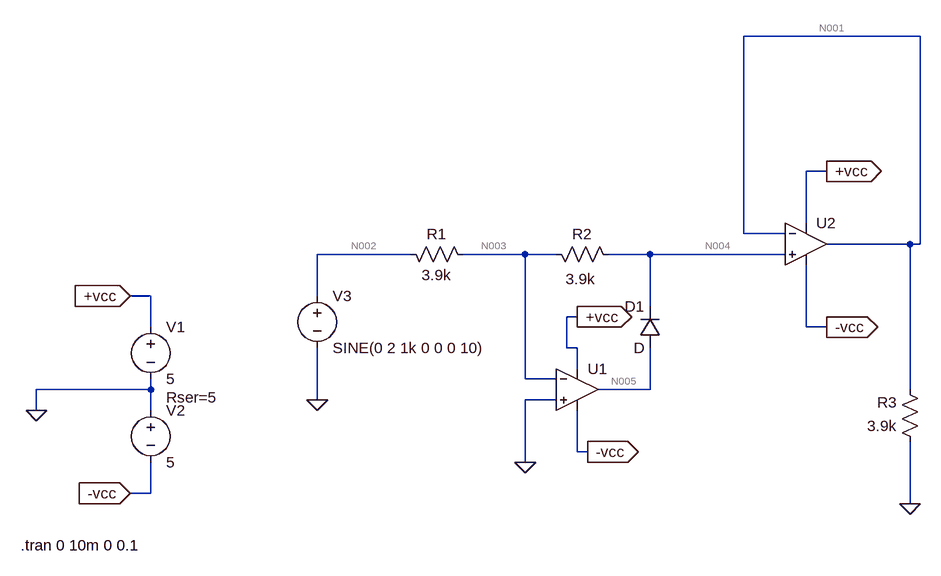
[diagram p0: schematic rectificador.asc]
rectificador.asc, the LTspice schematic file:
Version 4
SHEET 1 1236 680
WIRE 1184 -368 912 -368
WIRE 1040 -160 1008 -160
WIRE 1008 -80 1008 -160
WIRE 912 -64 912 -368
WIRE 976 -64 912 -64
WIRE 1168 -48 1040 -48
WIRE 1184 -48 1184 -368
WIRE 1184 -48 1168 -48
WIRE 400 -32 256 -32
WIRE 576 -32 480 -32
WIRE 624 -32 576 -32
WIRE 768 -32 704 -32
WIRE 976 -32 768 -32
WIRE 0 32 -32 32
WIRE 256 32 256 -32
WIRE 768 48 768 -32
WIRE 656 64 640 64
WIRE 0 80 0 32
WIRE 1008 80 1008 -16
WIRE 1040 80 1008 80
WIRE 640 112 640 64
WIRE 656 112 640 112
WIRE 656 144 656 112
WIRE 576 160 576 -32
WIRE 624 160 576 160
WIRE 0 176 0 160
WIRE 0 176 -176 176
WIRE 768 176 768 112
WIRE 768 176 688 176
WIRE 1168 176 1168 -48
WIRE 256 192 256 112
WIRE 624 192 576 192
WIRE -176 208 -176 176
WIRE 0 208 0 176
WIRE 656 272 656 208
WIRE 672 272 656 272
WIRE 576 288 576 192
WIRE 0 336 0 288
WIRE 0 336 -32 336
WIRE 1168 352 1168 256
FLAG -176 208 0
FLAG 256 192 0
FLAG 1168 352 0
FLAG 576 288 0
FLAG -32 32 +vcc
IOPIN -32 32 In
FLAG -32 336 -vcc
IOPIN -32 336 In
FLAG 656 64 +vcc
IOPIN 656 64 Out
FLAG 1040 -160 +vcc
IOPIN 1040 -160 Out
FLAG 1040 80 -vcc
IOPIN 1040 80 Out
FLAG 672 272 -vcc
IOPIN 672 272 Out
SYMBOL voltage 0 64 R0
WINDOW 123 0 0 Left 2
WINDOW 39 24 124 Left 2
SYMATTR SpiceLine Rser=5
SYMATTR InstName V1
SYMATTR Value 5
SYMBOL voltage 0 192 R0
WINDOW 123 0 0 Left 2
WINDOW 39 0 0 Left 2
SYMATTR InstName V2
SYMATTR Value 5
SYMBOL res 384 -48 M90
WINDOW 0 0 56 VBottom 2
WINDOW 3 32 56 VTop 2
SYMATTR InstName R1
SYMATTR Value 3.9k
SYMBOL res 608 -48 M90
WINDOW 0 0 56 VBottom 2
WINDOW 3 38 53 VTop 2
SYMATTR InstName R2
SYMATTR Value 3.9k
SYMBOL res 1184 272 R180
WINDOW 0 36 76 Left 2
WINDOW 3 36 40 Left 2
SYMATTR InstName R3
SYMATTR Value 3.9k
SYMBOL diode 784 112 R180
WINDOW 0 24 64 Left 2
WINDOW 3 24 0 Left 2
SYMATTR InstName D1
SYMBOL voltage 256 16 R0
WINDOW 123 0 0 Left 2
WINDOW 39 0 0 Left 2
SYMATTR InstName V3
SYMATTR Value SINE(0 2 1k 0 0 0 10)
SYMBOL Opamps\\UniversalOpamp2 656 176 R0
SYMATTR InstName U1
SYMBOL Opamps\\UniversalOpamp2 1008 -48 R0
SYMATTR InstName U2
TEXT -200 416 Left 2 !.tran 0 10m 0 0.1

The netlist it stands for:
* rectificador.asc
V1 +vcc 0 5 Rser=5
V2 0 -vcc 5
R1 N002 N003 3.9k
R2 N003 N004 3.9k
R3 0 N001 3.9k
D1 N005 N004 D
V3 N002 0 SINE(0 2 1k 0 0 0 10)
XU1 0 N003 +vcc -vcc N005 level.2 Avol=1Meg GBW=10Meg Slew=10Meg ilimit=25m rail=0 Vos=0 phimargin=45 en=0 enk=0 in=0 ink=0 Rin=500Meg  ; pins IN+ IN- V+ V- OUT
XU2 N004 N001 +vcc -vcc N001 level.2 Avol=1Meg GBW=10Meg Slew=10Meg ilimit=25m rail=0 Vos=0 phimargin=45 en=0 enk=0 in=0 ink=0 Rin=500Meg  ; pins IN+ IN- V+ V- OUT
.model D D
.lib standard.dio
.tran 0 10m 0 0.1
.lib UniversalOpamps2.sub
.backanno
.end

* Results of the author's LTspice run, read from the files saved beside the schematic
* Operating Point, zero values left out:
*   V(+vcc) = 4.995 V
*   V(-vcc) = -5 V
*   V(n003) = -38.72 nV
*   V(n004) = -57.95 nV
*   V(n001) = -60.46 nV
*   V(n005) = 36.04 mV
*   I(R3) = 15.5 pA
*   I(R2) = 4.931 pA
*   I(R1) = 9.928 pA
*   I(V3) = -9.928 pA
*   I(V2) = -999.4 µA
*   I(V1) = -999.4 µA
*   Ix(u1:1) = 4.997 pA
*   Ix(u1:2) = 4.997 pA
*   Ix(u1:3) = 499.7 µA
*   Ix(u1:4) = -499.7 µA
*   Ix(u2:1) = 4.997 pA
*   Ix(u2:2) = 4.997 pA
*   Ix(u2:3) = 499.7 µA
*   Ix(u2:4) = -499.7 µA
*   Ix(u2:5) = 10.5 pA
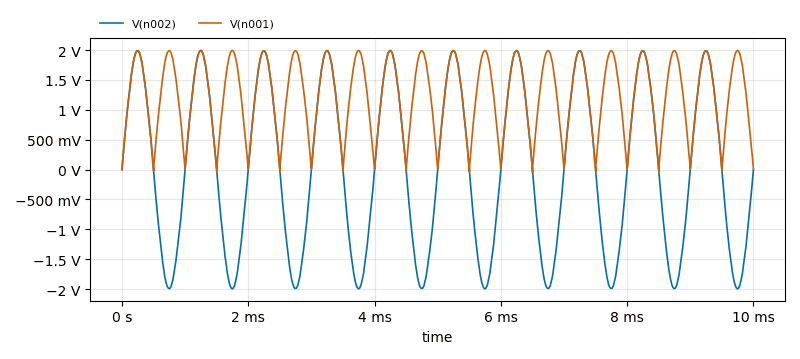
[diagram p1: Transient Analysis of rectificador.asc, plotted from the saved traces]
* Transient Analysis, 1 run:
*   V(n002): min -1.994 V, max 1.995 V, average -873 µV, rms 1.397 V, last 0 V
*   V(n001): min -45.81 mV, max 1.995 V, average 1.243 V, rms 1.397 V, last 12.79 mV